# EAGLE schematic Geiger_v3 (EAGLE 9.6.2)
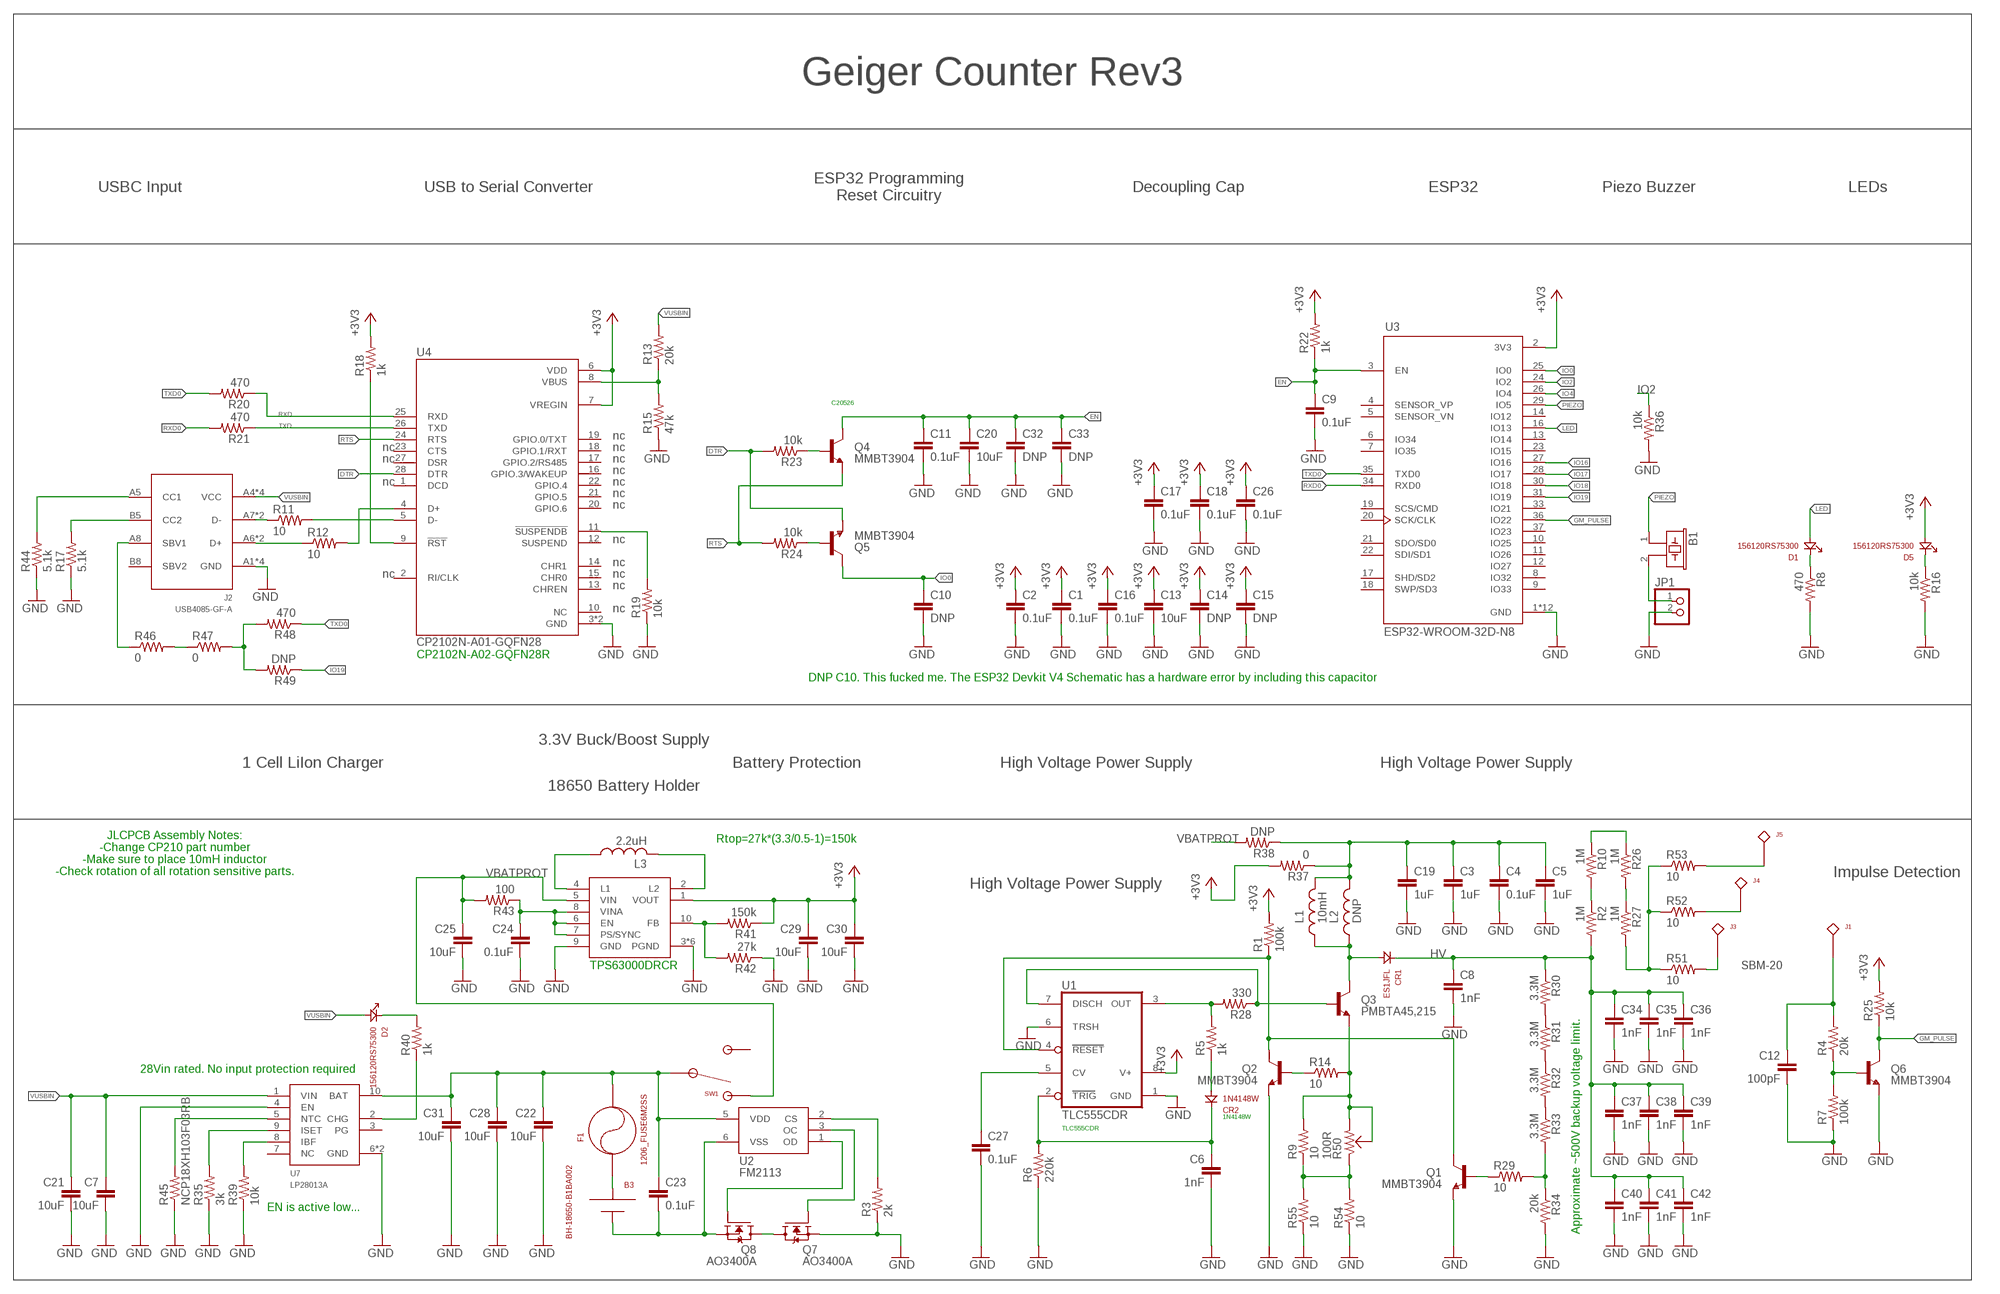
[diagram p0: schematic, sheet 1]

## Parts
B1  PIEZO17MM  [PS1740P02E]
B3  BH-18650-B1BA002  [18650]
C1  0.1uF  0603_CAPACITOR  [0603]
C2  0.1uF  0603_CAPACITOR  [0603]
C3  1uF  0603_CAPACITOR  [0603]
C4  0.1uF  0603_CAPACITOR  [0603]
C5  1uF  0603_CAPACITOR  [0603]
C6  1nF  0603_CAPACITOR  [0603]
C7  10uF  0603_CAPACITOR  [0603]
C8  1nF  1206_CAPACITOR  [1206]
C9  0.1uF  0603_CAPACITOR  [0603]
C10  DNP  0603_CAPACITOR  [0603]
C11  0.1uF  0603_CAPACITOR  [0603]
C12  100pF  0603_CAPACITOR  [0603]
C13  10uF  0603_CAPACITOR  [0603]
C14  DNP  0603_CAPACITOR  [0603]
C15  DNP  0603_CAPACITOR  [0603]
C16  0.1uF  0603_CAPACITOR  [0603]
C17  0.1uF  0603_CAPACITOR  [0603]
C18  0.1uF  0603_CAPACITOR  [0603]
C19  1uF  0603_CAPACITOR  [0603]
C20  10uF  0603_CAPACITOR  [0603]
C21  10uF  0603_CAPACITOR  [0603]
C22  10uF  0603_CAPACITOR  [0603]
C23  0.1uF  0603_CAPACITOR  [0603]
C24  0.1uF  0603_CAPACITOR  [0603]
C25  10uF  0603_CAPACITOR  [0603]
C26  0.1uF  0603_CAPACITOR  [0603]
C27  0.1uF  0603_CAPACITOR  [0603]
C28  10uF  0603_CAPACITOR  [0603]
C29  10uF  0603_CAPACITOR  [0603]
C30  10uF  0603_CAPACITOR  [0603]
C31  10uF  0603_CAPACITOR  [0603]
C32  DNP  0603_CAPACITOR  [0603]
C33  DNP  0603_CAPACITOR  [0603]
C34  1nF  1206_CAPACITOR  [1206]
C35  1nF  1206_CAPACITOR  [1206]
C36  1nF  1206_CAPACITOR  [1206]
C37  1nF  1206_CAPACITOR  [1206]
C38  1nF  1206_CAPACITOR  [1206]
C39  1nF  1206_CAPACITOR  [1206]
C40  1nF  1206_CAPACITOR  [1206]
C41  1nF  1206_CAPACITOR  [1206]
C42  1nF  1206_CAPACITOR  [1206]
CR1  ES1JFL  [SOD123(AK)]
CR2  1N4148W  BAS21GWX  [SOD123]
D1  156120RS75300  [1206_REV]
D2  156120RS75300  [1206_REV]
D5  156120RS75300  [1206_REV]
F1  1206_FUSE6M2SS  [1206_FUSE_6M2_SS]
J1  01010002Z  [01010002Z]
J2  USB4085-GF-A  [USBC]
J3  01010002Z  [01010002Z]
J4  01010002Z  [01010002Z]
J5  01010002Z  [01010002Z]
JP1  PINHD-1X2  [1X02]
L1  10mH  FNR8065S103MT  [FNR8065S]
L2  DNP  SDR1005-103KL  [SDR1005]
L3  2.2uH  CY43-2.2UH  [CY43]
Q1  MMBT3904  MMBT3904-TPCENTERED  [SOT23-3_CENTERED]
Q2  MMBT3904  MMBT3904-TPCENTERED  [SOT23-3_CENTERED]
Q3  PMBTA45,215  [SOT23-3]
Q4  MMBT3904  MMBT3904-TPCENTERED  [SOT23-3_CENTERED]
Q5  MMBT3904  MMBT3904-TPCENTERED  [SOT23-3_CENTERED]
Q6  MMBT3904  MMBT3904-TPCENTERED  [SOT23-3_CENTERED]
Q7  AO3400A  [SOT23-3_CENTERED]
Q8  AO3400A  [SOT23-3_CENTERED]
R1  100k  0603_RESISTOR  [0603]
R2  1M  0603_RESISTOR  [0603]
R3  2k  0603_RESISTOR  [0603]
R4  20k  0603_RESISTOR  [0603]
R5  1k  0603_RESISTOR  [0603]
R6  220k  0603_RESISTOR  [0603]
R7  100k  0603_RESISTOR  [0603]
R8  470  0603_RESISTOR  [0603]
R9  10  0603_RESISTOR  [0603]
R10  1M  0603_RESISTOR  [0603]
R11  10  0603_RESISTOR  [0603]
R12  10  0603_RESISTOR  [0603]
R13  20k  0603_RESISTOR  [0603]
R14  10  0603_RESISTOR  [0603]
R15  47k  0603_RESISTOR  [0603]
R16  10k  0603_RESISTOR  [0603]
R17  5.1k  0603_RESISTOR  [0603]
R18  1k  0603_RESISTOR  [0603]
R19  10k  0603_RESISTOR  [0603]
R20  470  0603_RESISTOR  [0603]
R21  470  0603_RESISTOR  [0603]
R22  1k  0603_RESISTOR  [0603]
R23  10k  0603_RESISTOR  [0603]
R24  10k  0603_RESISTOR  [0603]
R25  10k  0603_RESISTOR  [0603]
R26  1M  0603_RESISTOR  [0603]
R27  1M  0603_RESISTOR  [0603]
R28  330  0603_RESISTOR  [0603]
R29  10  0603_RESISTOR  [0603]
R30  3.3M  0603_RESISTOR  [0603]
R31  3.3M  0603_RESISTOR  [0603]
R32  3.3M  0603_RESISTOR  [0603]
R33  3.3M  0603_RESISTOR  [0603]
R34  20k  0603_RESISTOR  [0603]
R35  3k  0603_RESISTOR  [0603]
R36  10k  0603_RESISTOR  [0603]
R37  0  0603_RESISTOR  [0603]
R38  DNP  0603_RESISTOR  [0603]
R39  10k  0603_RESISTOR  [0603]
R40  1k  0603_RESISTOR  [0603]
R41  150k  0603_RESISTOR  [0603]
R42  27k  0603_RESISTOR  [0603]
R43  100  0603_RESISTOR  [0603]
R44  5.1k  0603_RESISTOR  [0603]
R45  NCP18XH103F03RB  0603_RESISTOR  [0603]
R46  0  1206_RESISTOR  [1206]
R47  0  1206_RESISTOR  [1206]
R48  470  0603_RESISTOR  [0603]
R49  DNP  0603_RESISTOR  [0603]
R50  100R  ST-4ETB101  [ST-4]
R51  10  0603_RESISTOR  [0603]
R52  10  0603_RESISTOR  [0603]
R53  10  0603_RESISTOR  [0603]
R54  10  0603_RESISTOR  [0603]
R55  10  0603_RESISTOR  [0603]
SW1  SPDT  100SP1T2B4M6QE  [TOGGLE_RA]
U1  TLC555CDR  TLC555CDG4  [SOIC8]
U2  FM2113  [SOT23-6]
U3  ESP32-WROOM-32D-N8  ESP32-WROOM-32D  [MODULE_ESP32-WROOM-32D]
U4  CP2102N-A01-GQFN28  [QFN50P500X500X80-29N]
U6  TPS63000DRCR  [S-PVSON-N10]
U7  LP28013A  [10DFN]

## Nets
+3V3: C1.1 C2.1 C13.1 C14.1 C15.1 C16.1 C17.1 C18.1 C26.1 C29.1 C30.1 D5.A R1.2 R18.2 R22.2 R25.2 R37.2 R41.1 U1.8(V+) U3.2(3V3) U4.6(VDD) U4.7(VREGIN) U6.1(VOUT)
DTR: Q5.2(E) R23.2 U4.28(DTR)
EN: C9.1 C11.1 C20.1 C32.1 C33.1 Q4.3(C) R22.1 U3.3(EN)
GM_PULSE: Q6.3(C) R25.1 U3.36(IO22)
GND: C1.2 C2.2 C3.2 C4.2 C5.2 C6.2 C7.2 C8.2 C9.2 C10.2 C11.2 C12.2 C13.2 C14.2 C15.2 C16.2 C17.2 C18.2 C19.2 C20.2 C21.2 C22.2 C24.2 C25.2 C26.2 C27.2 C28.2 C29.2 C30.2 C31.2 C32.2 C33.2 C34.2 C35.2 C36.2 C37.2 C38.2 C39.2 C40.2 C41.2 C42.2 J2.A1(GND) J2.A12(GND) J2.B1(GND) J2.B12(GND) JP1.2 Q1.2(E) Q2.2(E) Q6.2(E) Q7.2(S) R3.1 R6.1 R7.1 R8.2 R15.1 R16.2 R17.1 R19.1 R34.2 R35.1 R36.2 R39.1 R42.1 R44.1 R45.1 R54.1 R55.1 U1.1(GND) U1.6(TRSH) U3.1(GND) U3.15(GND) U3.38(GND) U3.39_1(GND) U3.39_2(GND) U3.39_3(GND) U3.39_4(GND) U3.39_5(GND) U3.39_6(GND) U3.39_7(GND) U3.39_8(GND) U3.39_9(GND) U4.3(GND) U4.29(GND) U6.3(PGND) U6.9(GND) U6.PG1(PGND) U6.PG2(PGND) U6.PG3(PGND) U6.PG4(PGND) U6.PG(PGND) U7.4(EN) U7.6(GND) U7.GF(GND)
HV [HV]: C8.1 C34.1 C35.1 C36.1 C37.1 C38.1 C39.1 C40.1 C41.1 C42.1 CR1.K R2.2 R30.1
IO0: C10.1 Q5.3(C) U3.25(IO0)
IO2: R36.1 U3.24(IO2)
IO4: U3.26(IO4)
IO16: U3.27(IO16)
IO17: U3.28(IO17)
IO18: U3.30(IO18)
IO19: R49.1 U3.31(IO19)
LED: D1.A U3.16(IO13)
N$1: CR2.2(A) R5.1
N$2: J2.A7(D-) J2.B7(D-) R11.1
N$3: Q1.3(C) Q2.3(C) R1.1 U1.4(RESET)
N$4: J2.A6(D+) J2.B6(D+) R12.1
N$5: R11.2 U4.5(D-)
N$6: R12.2 U4.4(D+)
N$7: R13.1 R15.2 U4.8(VBUS)
N$8: Q3.1(B) R28.1 U1.7(DISCH)
N$9: C6.1 CR2.1(K) R6.2 U1.2(TRIG)
N$10: R5.2 R28.2 U1.3(OUT)
N$11: Q3.2(E) R9.2 R14.2 R50.1 R50.2(ADJ)
N$12: B1.2 JP1.1
N$13: Q2.1(B) R14.1
N$14: Q6.1(B) R4.1 R7.2
N$15 [HV]: J4.P$1 R52.2
N$16 [HV]: R2.1 R10.2
N$17 [HV]: R10.1 R26.1
N$18: R18.1 U4.9(!RST)
N$19: D5.K R16.1
N$20: R19.2 U4.11(!SUSPENDB)
N$21 [HV]: R26.2 R27.1
N$22: Q4.1(B) R23.1
N$23: R39.2 U7.8(IBF)
N$24: Q5.1(B) R24.1
N$25: J2.B5(CC2) R17.2
N$26: Q1.1(B) R29.1
N$27: D1.K R8.1
N$28 [HV]: R31.2 R32.1
N$29: R29.2 R33.2 R34.1
N$30 [HV]: R30.2 R31.1
N$31 [HV]: R32.2 R33.1
N$32: J2.A5(CC1) R44.2
N$33: C27.1 U1.5(CV)
N$34: R40.1 U7.2(CHG)
N$35: C3.1 C4.1 C5.1 C19.1 L1.P$2 L2.P$2 R37.1 R38.1
N$36: R35.2 U7.9(ISET)
N$37: D2.K R40.2
N$38: R45.2 U7.5(NTC)
N$39: C12.1 J1.P$1 R4.2
N$40: B3.- C23.2 Q8.2(S) U2.6(VSS)
N$41: C22.1 C23.1 C28.1 C31.1 F1.P$2 SW1.2(COM) U2.5(VDD) U7.10(BAT)
N$42: Q8.1(G) U2.1(OD)
N$43: Q7.3(D) Q8.3(D)
N$44: L3.P$1 U6.4(L1)
N$45: Q7.1(G) U2.3(OC)
N$46: R3.2 U2.2(CS)
N$47: L3.P$2 U6.2(L2)
N$48: R41.2 R42.2 U6.10(FB)
N$49: C24.1 R43.1 U6.6(EN) U6.7(PS/SYNC) U6.8(VINA)
N$50: J2.A8(SBV1) R46.1
N$51: R46.2 R47.1
N$52: R47.2 R48.2 R49.2
N$53 [HV]: J5.P$1 R53.2
N$54 [HV]: R27.2 R51.1 R52.1 R53.1
N$55 [HV]: J3.P$1 R51.2
N$56: R9.1 R50.3 R54.2 R55.2
PIEZO: B1.1 U3.29(IO5)
RAWBATT [HV]: B3.+ F1.P$1
RTS: Q4.2(E) R24.2 U4.24(RTS)
RXD: R20.1 U4.25(RXD)
RXD0: R21.2 U3.34(RXD0)
SW [HV]: CR1.A L1.P$1 L2.P$1 Q3.3(C)
TXD: R21.1 U4.26(TXD)
TXD0: R20.2 R48.1 U3.35(TXD0)
VBATPROT: C25.1 R38.2 R43.2 SW1.3 U6.5(VIN)
VUSBIN: C7.1 C21.1 D2.A J2.A4(VCC) J2.A9(VCC) J2.B4(VCC) J2.B9(VCC) R13.2 U7.1(VIN)
Unconnected: J2.B8(SBV2) SW1.1 U3.4(SENSOR_VP) U3.5(SENSOR_VN) U3.6(IO34) U3.7(IO35) U3.8(IO32) U3.9(IO33) U3.10(IO25) U3.11(IO26) U3.12(IO27) U3.13(IO14) U3.14(IO12) U3.17(SHD/SD2) U3.18(SWP/SD3) U3.19(SCS/CMD) U3.20(SCK/CLK) U3.21(SDO/SD0) U3.22(SDI/SD1) U3.23(IO15) U3.33(IO21) U3.37(IO23) U4.1(DCD) U4.2(RI/CLK) U4.10(NC) U4.12(SUSPEND) U4.13(CHREN) U4.14(CHR1) U4.15(CHR0) U4.16(GPIO.3/WAKEUP) U4.17(GPIO.2/RS485) U4.18(GPIO.1/RXT) U4.19(GPIO.0/TXT) U4.20(GPIO.6) U4.21(GPIO.5) U4.22(GPIO.4) U4.23(CTS) U4.27(DSR) U7.3(PG) U7.7(NC)

## Notes on the sheet
- Geiger Counter Rev3
- USBC Input | USB to Serial Converter
- ESP32 Programming
  Reset Circuitry
- Decoupling Cap | ESP32 | Piezo Buzzer | LEDs
- C20526
- nc
- nc | nc
- nc | nc
- nc
- nc | nc
- nc
- nc
- nc
- nc
- nc | nc
- nc
- nc
- CP2102N-A02-GQFN28R
- DNP C10. This fucked me. The ESP32 Devkit V4 Schematic has a hardware error by including this capacitor
- 3.3V Buck/Boost Supply
- 1 Cell LiIon Charger | Battery Protection | High Voltage Power Supply | High Voltage Power Supply
- 18650 Battery Holder
- JLCPCB Assembly Notes:
  -Change CP210 part number
  -Make sure to place 10mH inductor
  -Check rotation of all rotation sensitive parts.
- Rtop=27k*(3.3/0.5-1)=150k
- Impulse Detection
- High Voltage Power Supply
- TPS63000DRCR | SBM-20
- 28Vin rated. No input protection required
- 1N4148W
- TLC555CDR
- EN is active low...
- Approximate ~500V backup voltage limit.

## Library data of the parts
B1 = mightyohm:PIEZO; OC_FARNELL: unknown; OC_NEWARK: unknown
B3 = ruark2:BH-18650-B1BA002: 18650 JLCPCB C2988620
C1-C7 C9-C33 = ruark2:0603_CAPACITOR: 0603 Capacitor -- WARNING: NO DEFINED VALUE OR PART NUMBER; VALUE: sel
C8 C34-C42 = ruark2a:1206_CAPACITOR: NO DEFINED PN; VALUE: sel
CR1 = ruark2:ES1JFL: Diode Standard 600 V 1A Surface Mount SOD-123F; PARTNO: ES1JFLCT-ND
CR2 = ruark2:BAS21GWX: Diode Standard 200V 225mA (DC) Surface Mount SOD-123; PARTNO: 1727-7323-1-ND
D1 D2 D5 = ruark2:156120RS75300: Red 624nm LED Indication - Discrete 2V 1206 Reverse Mount (3216 Metric); PARTNO: 732-5031-1-ND
F1 = ruark2:1206_FUSE
J1 J3-J5 = ruark2:01010002Z: SMD Fuse Clip 15 A 250V 1 Circuit Cartridge Chassis Mount; PARTNO: F4080-ND
J2 = ruark2a:USB4085-GF-A: USB - C USB 2.0 Receptacle Connector 16 Position Through Hole, Right Angle; PARTNO: 2073-USB4085-GF-ACT-ND
JP1 = pinhead:PINHD-1X2: PIN HEADER
L1 = ruark2:FNR8065S103MT: 130mA 10mH ±20% 22.8Ω SMD Power Inductors ROHS
L2 = ruark2:SDR1005-103KL: 10 mH Unshielded Wirewound Inductor 100 mA 39Ohm Max Nonstandard 100mA; PARTNO: SDR1005-103KLCT-ND; VALUE: 10mH
L3 = ruark2a:CY43-2.2UH: 2.3A 2.2uH ±20% 42mΩ SMD,4x4.5mm Inductors (SMD) ROHS; JLCPCB: C2929416
Q1 Q2 Q4-Q6 = ruark2a:MMBT3904-TP: Bipolar (BJT) Transistor NPN 40V 200mA 300MHz 350mW Surface Mount SOT-23 (SMD 2N3904)
Q3 = ruark2:PMBTA45,215: Bipolar (BJT) Transistor NPN 500 V 150 mA 35MHz 300 mW Surface Mount TO-236AB; PARTNO: 1727-5332-1-ND
Q7 Q8 = ruark2a:AO3400A: N-Channel 5.7A (Ta) 1.4W (Ta) Surface Mount SOT-23-3L
R1-R45 R48 R49 R51-R55 = ruark2:0603_RESISTOR: 0603 Resistor -- WARNING: NO DEFINED PART NUMBER OR VALUE; VALUE: sel
R46 R47 = ruark2a:1206_RESISTOR: NO DEFINED PN; VALUE: sel
R50 = ruark2:ST-4ETB101: ±20% ±100ppm/℃ 250mW 100Ω SMD Variable Resistors/Potentiometers ROHS; JLCPCB: C2922093
SW1 = ruark2:100SP1T2B4M6QE: Toggle Switch SPDT Through Hole, Right Angle 5A 120V; PARTNO: EG2362-ND
U1 = ruark2:TLC555CDG4: 555 Type, Timer/Oscillator (Single) IC 2.1MHz 8-SOIC; PARTNO: 296-52992-ND
U2 = ruark2a:FM2113: SOT-23-6 Battery Protection UVLO, OV, OC
U3 = ESP32-WROOM-32D:ESP32-WROOM-32D: Bluetooth, WiFi 802.11b/g/n, Bluetooth v4.2 + EDR, Class 1, 2 and 3 Transceiver Module 2.4GHz ~ 2.5GHz Integrated, Trace Surface Mount Check prices <https://pricing.snapeda.com/parts/ESP32-WROOM-32D/Espressif%20Systems/view-part?ref=eda>; AVAILABILITY: Bad; DESCRIPTION: Bluetooth, WiFi 802.11b/g/n, Bluetooth v4.2 +EDR, Class 1, 2 and 3 Transceiver Module 2.4GHz ~ 2.5GHz Integrated, Trace Surface Mount; MF: Espressif Systems; MP: ESP32-WROOM-32D; PACKAGE: Module Espressif Systems; PRICE: None
U4 = CP2102N-A01-GQFN28:CP2102N-A01-GQFN28: USB Bridge, USB to UART USB 2.0 UART Interface 28-QFN (5x5) Check availability <https://pricing.snapeda.com/parts/CP2102N-A01-GQFN28/Silicon%20Labs/view-part?ref=eda>; AVAILABILITY: In Stock; DESCRIPTION: USB Bridge, USB to UART USB 2.0 UART Interface 28-QFN (5x5); MF: Silicon Labs; MP: CP2102N-A01-GQFN28; PACKAGE: WFQFN-28 Silicon Labs; PRICE: None
U6 = ruark2a:TPS63000DRCR: Buck-Boost Switching Regulator IC Positive Adjustable 1.2V 1 Output 1.6A (Switch) 10-VFDFN Exposed Pad; PARTNO: 296-19641-1-ND
U7 = ruark2:LP28013A: TDFN-10 Battery Management ICs ROHS JLCPCB: C517139

## Net classes
1 HV: clearance 1.27 mm